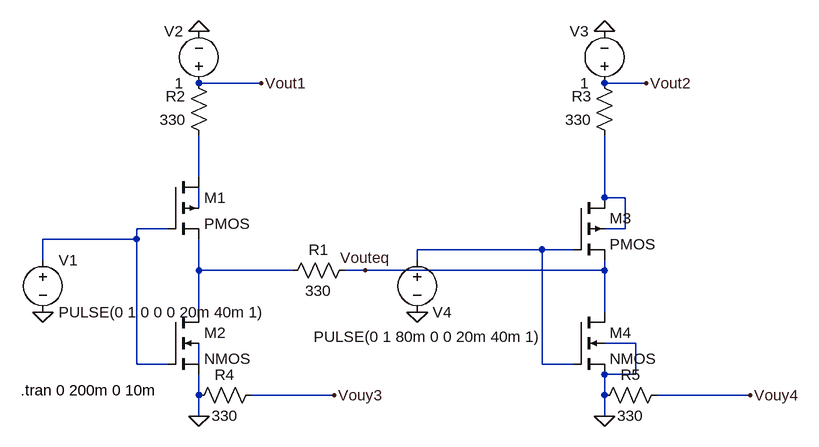
[diagram p0: schematic cmos_testing.asc]
cmos_testing.asc, the LTspice schematic file:
Version 4
SHEET 1 1112 680
WIRE 272 -64 176 -64
WIRE 864 -64 800 -64
WIRE 176 80 176 16
WIRE 800 112 800 16
WIRE 832 112 800 112
WIRE 176 128 176 96
WIRE 128 160 80 160
WIRE 832 160 832 112
WIRE 832 160 800 160
WIRE 80 176 80 160
WIRE 80 176 -64 176
WIRE 704 192 512 192
WIRE 752 192 704 192
WIRE -64 208 -64 176
WIRE 512 208 512 192
WIRE 176 224 176 176
WIRE 320 224 176 224
WIRE 432 224 400 224
WIRE 800 224 800 208
WIRE 800 224 432 224
WIRE 176 288 176 224
WIRE 800 288 800 224
WIRE 848 336 800 336
WIRE 80 368 80 176
WIRE 128 368 80 368
WIRE 176 368 176 336
WIRE 704 368 704 192
WIRE 752 368 704 368
WIRE 848 384 848 336
WIRE 848 384 800 384
WIRE 176 416 176 384
WIRE 384 416 256 416
WIRE 800 416 800 384
WIRE 1024 416 880 416
WIRE 176 448 176 416
WIRE 800 448 800 416
FLAG -64 288 0
FLAG 176 -144 0
FLAG 512 288 0
FLAG 800 -144 0
FLAG 272 -64 Vout1
FLAG 864 -64 Vout2
FLAG 176 448 0
FLAG 800 448 0
FLAG 384 416 Vouy3
FLAG 1024 416 Vouy4
FLAG 432 224 Vouteq
SYMBOL voltage -64 192 R0
WINDOW 123 0 0 Left 0
WINDOW 39 0 0 Left 0
SYMATTR InstName V1
SYMATTR Value PULSE(0 1 0 0 0 20m 40m 1)
SYMBOL voltage 176 -48 R180
WINDOW 0 24 96 Left 2
WINDOW 3 24 16 Left 2
WINDOW 123 0 0 Left 0
WINDOW 39 0 0 Left 0
SYMATTR InstName V2
SYMATTR Value 1
SYMBOL pmos4 128 80 R0
SYMATTR InstName M1
SYMBOL nmos4 128 288 R0
SYMATTR InstName M2
SYMBOL voltage 800 -48 R180
WINDOW 0 24 96 Left 2
WINDOW 3 24 16 Left 2
WINDOW 123 0 0 Left 0
WINDOW 39 0 0 Left 0
SYMATTR InstName V3
SYMATTR Value 1
SYMBOL voltage 512 192 R0
WINDOW 0 24 96 Left 2
WINDOW 3 -159 134 Left 2
WINDOW 123 0 0 Left 0
WINDOW 39 0 0 Left 0
SYMATTR InstName V4
SYMATTR Value PULSE(0 1 80m 0 0 20m 40m 1)
SYMBOL pmos4 752 112 R0
SYMATTR InstName M3
SYMBOL nmos4 752 288 R0
SYMATTR InstName M4
SYMBOL res 416 208 R90
WINDOW 0 0 56 VBottom 2
WINDOW 3 32 56 VTop 2
SYMATTR InstName R1
SYMATTR Value 330
SYMBOL res 192 32 R180
WINDOW 0 36 76 Left 2
WINDOW 3 36 40 Left 2
SYMATTR InstName R2
SYMATTR Value 330
SYMBOL res 816 32 R180
WINDOW 0 36 76 Left 2
WINDOW 3 36 40 Left 2
SYMATTR InstName R3
SYMATTR Value 330
SYMBOL res 272 400 R90
WINDOW 0 0 56 VBottom 2
WINDOW 3 32 56 VTop 2
SYMATTR InstName R4
SYMATTR Value 330
SYMBOL res 896 400 R90
WINDOW 0 0 56 VBottom 2
WINDOW 3 32 56 VTop 2
SYMATTR InstName R5
SYMATTR Value 330
TEXT -98 408 Left 2 !.tran 0 200m 0 10m

The netlist it stands for:
* cmos_testing.asc
V1 N004 0 PULSE(0 1 0 0 0 20m 40m 1)
V2 Vout1 0 1
M1 N001 N004 N006 N003 PMOS
M2 N006 N004 0 N007 NMOS
V3 Vout2 0 1
V4 N005 0 PULSE(0 1 80m 0 0 20m 40m 1)
M3 N002 N005 Vouteq N002 PMOS
M4 Vouteq N005 0 0 NMOS
R1 Vouteq N006 330
R2 N001 Vout1 330
R3 N002 Vout2 330
R4 Vouy3 0 330
R5 Vouy4 0 330
.model NMOS NMOS
.model PMOS PMOS
.lib standard.mos
.tran 0 200m 0 10m
.backanno
.end